# EAGLE design random (EAGLE 7.2.0)
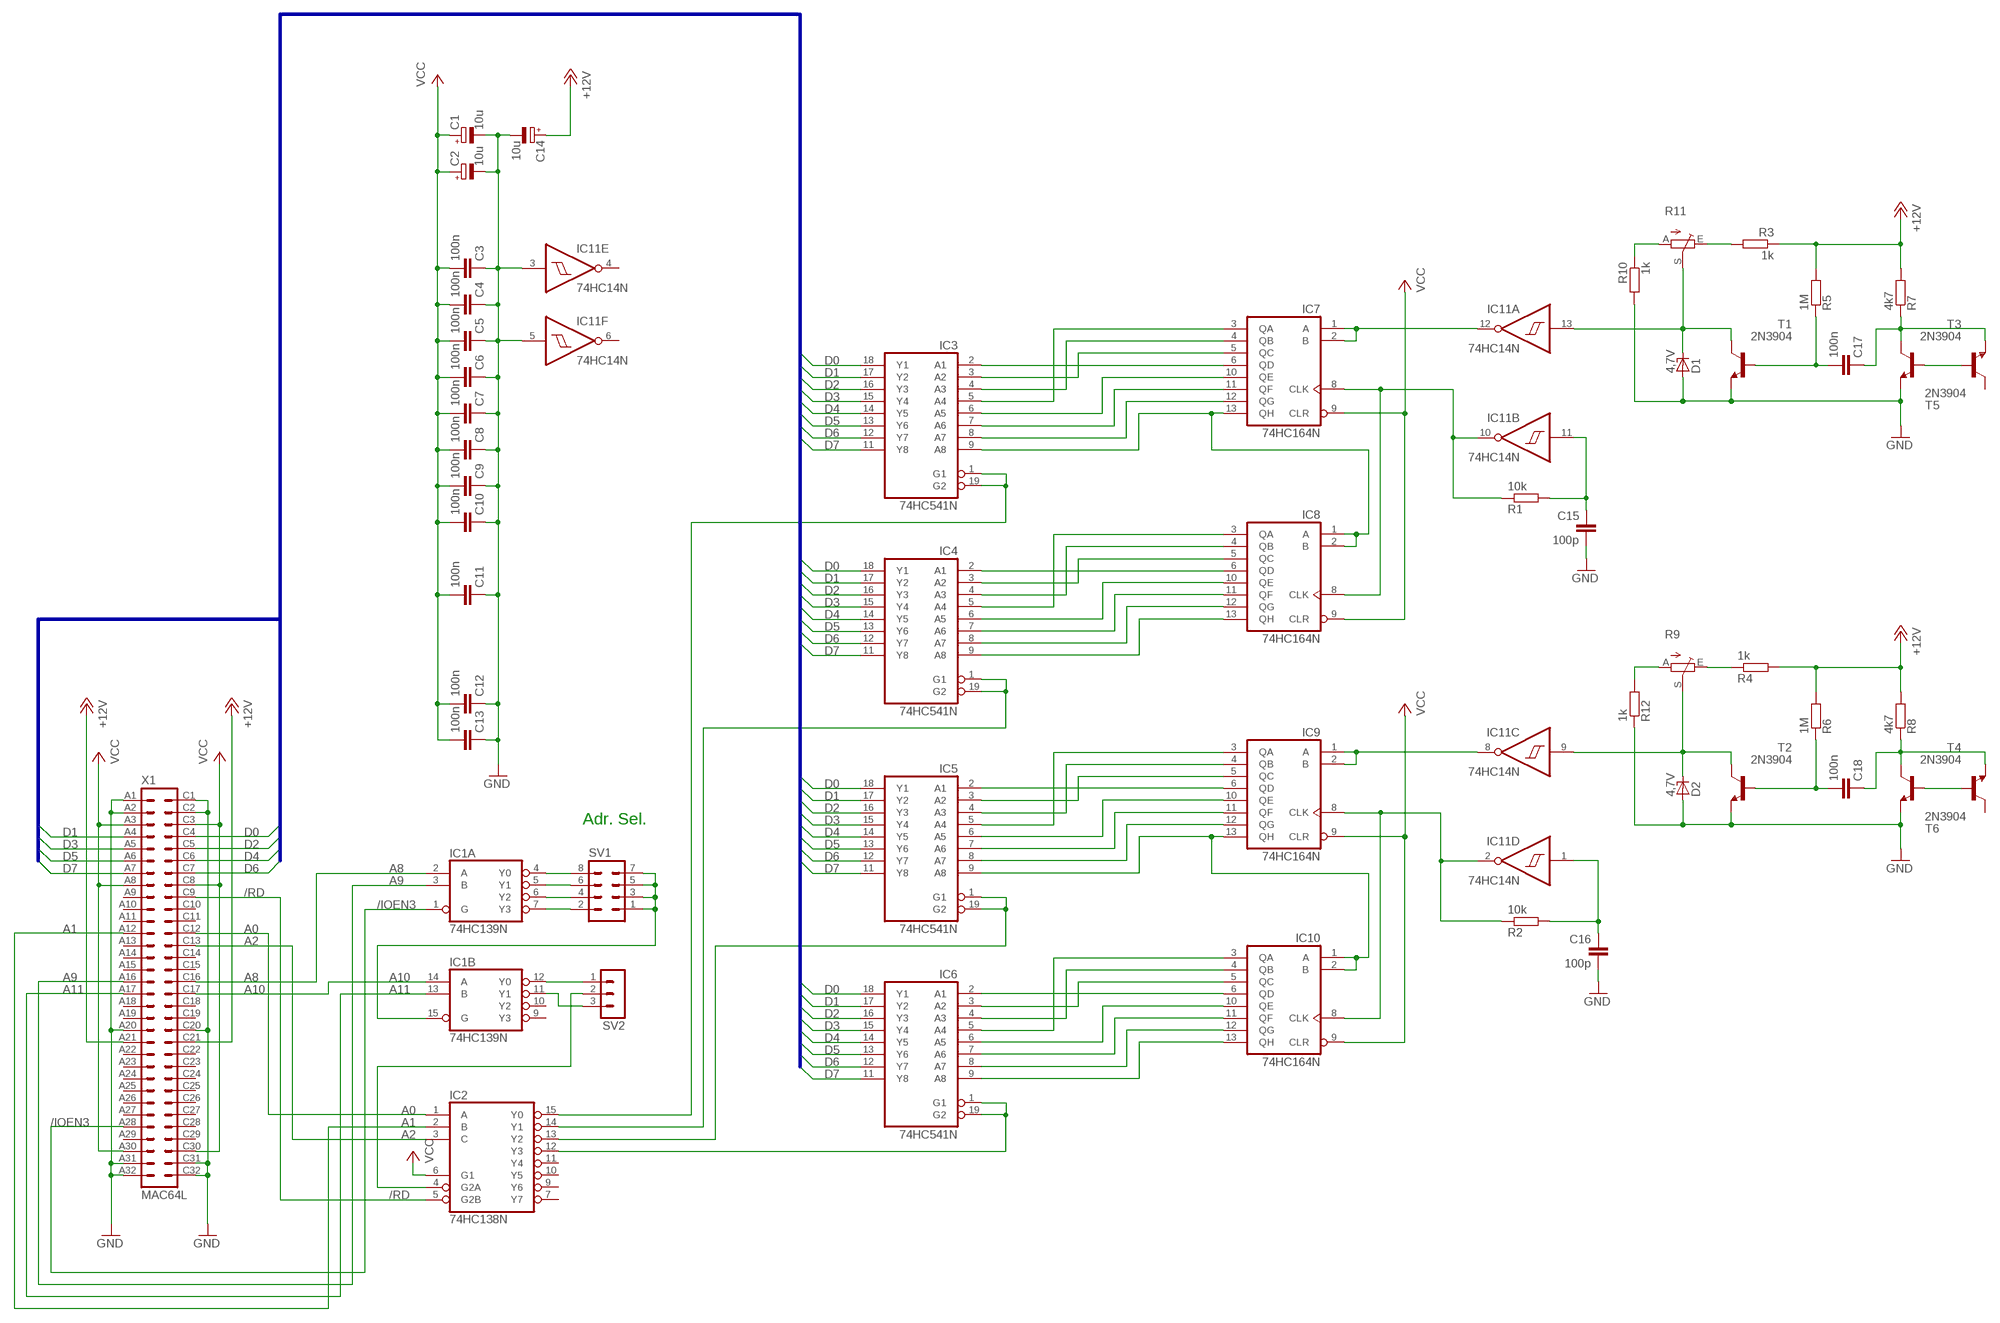
[diagram p0: schematic, sheet 1]

## Parts
C1  10u  CPOL-EUTT2D4  [TT2D4]
C2  10u  CPOL-EUTT2D4  [TT2D4]
C3  100n  C-EU025-024X044  [C025-024X044]
C4  100n  C-EU025-024X044  [C025-024X044]
C5  100n  C-EU025-024X044  [C025-024X044]
C6  100n  C-EU025-024X044  [C025-024X044]
C7  100n  C-EU025-024X044  [C025-024X044]
C8  100n  C-EU025-024X044  [C025-024X044]
C9  100n  C-EU025-024X044  [C025-024X044]
C10  100n  C-EU025-024X044  [C025-024X044]
C11  100n  C-EU025-024X044  [C025-024X044]
C12  100n  C-EU025-024X044  [C025-024X044]
C13  100n  C-EU025-024X044  [C025-024X044]
C14  10u  CPOL-EUTT2D4  [TT2D4]
C15  100p  C-EU025-024X044  [C025-024X044]
C16  100p  C-EU025-024X044  [C025-024X044]
C17  100n  C-EU025-024X044  [C025-024X044]
C18  100n  C-EU025-024X044  [C025-024X044]
D1  4,7V  ZENER-DIODEZD-7.5  [ZDIO-7.5]
D2  4,7V  ZENER-DIODEZD-7.5  [ZDIO-7.5]
IC1  74HC139N  [DIL16]
IC2  74HC138N  [DIL16]
IC3  74HC541N  [DIL20]
IC4  74HC541N  [DIL20]
IC5  74HC541N  [DIL20]
IC6  74HC541N  [DIL20]
IC7  74HC164N  [DIL14]
IC8  74HC164N  [DIL14]
IC9  74HC164N  [DIL14]
IC10  74HC164N  [DIL14]
IC11  74HC14N  [DIL14]
R1  10k  R-EU_0204/7  [0204/7]
R2  10k  R-EU_0204/7  [0204/7]
R3  1k  R-EU_0204/7  [0204/7]
R4  1k  R-EU_0204/7  [0204/7]
R5  1M  R-EU_0204/7  [0204/7]
R6  1M  R-EU_0204/7  [0204/7]
R7  4k7  R-EU_0204/7  [0204/7]
R8  4k7  R-EU_0204/7  [0204/7]
R9  TRIM_EU-S63X  [S63X]
R10  1k  R-EU_0204/7  [0204/7]
R11  TRIM_EU-S63X  [S63X]
R12  1k  R-EU_0204/7  [0204/7]
SV1  MA04-2  [MA04-2]
SV2  MA03-1  [MA03-1]
T1  2N3904  [TO92]
T2  2N3904  [TO92]
T3  2N3904  [TO92]
T4  2N3904  [TO92]
T5  2N3904  [TO92]
T6  2N3904  [TO92]
X1  MAC64L  [MAC64L]

## Nets
+12V: C14.+ R3.1 R4.2 R5.2 R6.2 R7.2 R8.2 X1.A21 X1.C21
/IOEN3: IC1.1(A:G) X1.A28
/RD: IC2.5(G2B) X1.C9
A0: IC2.1(A) X1.C12
A1: IC2.2(B) X1.A12
A2: IC2.3(C) X1.C13
A8: IC1.2(A:A) X1.C16
A9: IC1.3(A:B) X1.A16
A10: IC1.14(B:A) X1.C17
A11: IC1.13(B:B) X1.A17
D0: IC3.18(Y1) IC4.18(Y1) IC5.18(Y1) IC6.18(Y1) X1.C4
D1: IC3.17(Y2) IC4.17(Y2) IC5.17(Y2) IC6.17(Y2) X1.A4
D2: IC3.16(Y3) IC4.16(Y3) IC5.16(Y3) IC6.16(Y3) X1.C5
D3: IC3.15(Y4) IC4.15(Y4) IC5.15(Y4) IC6.15(Y4) X1.A5
D4: IC3.14(Y5) IC4.14(Y5) IC5.14(Y5) IC6.14(Y5) X1.C6
D5: IC3.13(Y6) IC4.13(Y6) IC5.13(Y6) IC6.13(Y6) X1.A6
D6: IC3.12(Y7) IC4.12(Y7) IC5.12(Y7) IC6.12(Y7) X1.C7
D7: IC3.11(Y8) IC4.11(Y8) IC5.11(Y8) IC6.11(Y8) X1.A7
GND: C1.- C2.- C3.1 C4.1 C5.1 C6.1 C7.1 C8.1 C9.1 C10.1 C11.1 C12.1 C13.1 C14.- C15.2 C16.2 D1.A D2.A IC11.3(E:I) IC11.5(F:I) R10.2 R12.1 T1.3(E) T2.3(E) T3.3(E) T4.3(E) X1.A1 X1.A2 X1.A20 X1.A31 X1.A32 X1.C1 X1.C2 X1.C20 X1.C31 X1.C32
N$1: T3.2(B) T5.2(B)
N$2: C17.1 R7.1 T3.1(C) T5.3(E)
N$3: C17.2 R5.1 T1.2(B)
N$4: D1.C IC11.13(A:I) R11.S T1.1(C)
N$5: T4.2(B) T6.2(B)
N$6: C18.1 R8.1 T4.1(C) T6.3(E)
N$7: C18.2 R6.1 T2.2(B)
N$8: D2.C IC11.9(C:I) R9.S T2.1(C)
N$9: C16.1 IC11.1(D:I) R2.2
N$10: IC7.8(CLK) IC8.8(CLK) IC11.10(B:O) R1.1
N$11: C15.1 IC11.11(B:I) R1.2
N$12: IC9.1(A) IC9.2(B) IC11.8(C:O)
N$13: IC5.9(A8) IC9.13(QH) IC10.1(A) IC10.2(B)
N$15: R3.2 R11.E
N$16: R10.1 R11.A
N$17: R4.1 R9.E
N$18: R9.A R12.2
N$20: IC5.2(A1) IC9.6(QD)
N$21: IC5.3(A2) IC9.5(QC)
N$22: IC7.1(A) IC7.2(B) IC11.12(A:O)
N$23: IC3.9(A8) IC7.13(QH) IC8.1(A) IC8.2(B)
N$24: IC5.4(A3) IC9.4(QB)
N$26: IC3.8(A7) IC7.12(QG)
N$27: IC3.7(A6) IC7.11(QF)
N$28: IC3.6(A5) IC7.10(QE)
N$29: IC3.2(A1) IC7.6(QD)
N$30: IC3.3(A2) IC7.5(QC)
N$31: IC3.4(A3) IC7.4(QB)
N$32: IC4.2(A1) IC8.6(QD)
N$33: IC4.3(A2) IC8.5(QC)
N$34: IC4.4(A3) IC8.4(QB)
N$35: IC4.5(A4) IC8.3(QA)
N$36: IC4.6(A5) IC8.10(QE)
N$37: IC4.7(A6) IC8.11(QF)
N$38: IC4.8(A7) IC8.12(QG)
N$39: IC4.9(A8) IC8.13(QH)
N$40: IC5.5(A4) IC9.3(QA)
N$41: IC5.6(A5) IC9.10(QE)
N$42: IC9.8(CLK) IC10.8(CLK) IC11.2(D:O) R2.1
N$44: IC5.7(A6) IC9.11(QF)
N$45: IC5.8(A7) IC9.12(QG)
N$46: IC6.2(A1) IC10.6(QD)
N$47: IC6.3(A2) IC10.5(QC)
N$48: IC6.4(A3) IC10.4(QB)
N$49: IC6.5(A4) IC10.3(QA)
N$50: IC6.6(A5) IC10.10(QE)
N$51: IC6.7(A6) IC10.11(QF)
N$52: IC6.8(A7) IC10.12(QG)
N$53: IC6.9(A8) IC10.13(QH)
N$72: IC1.15(B:G) SV1.1 SV1.3 SV1.5 SV1.7
N$73: IC1.4(A:Y0) SV1.8
N$74: IC1.5(A:Y1) SV1.6
N$75: IC1.6(A:Y2) SV1.4
N$76: IC1.7(A:Y3) SV1.2
N$77: IC1.12(B:Y0) SV2.1
N$78: IC1.11(B:Y1) SV2.3
N$79: IC2.4(G2A) SV2.2
N$80: IC2.15(Y0) IC3.1(G1) IC3.19(G2)
N$81: IC2.14(Y1) IC4.1(G1) IC4.19(G2)
N$82: IC2.13(Y2) IC5.1(G1) IC5.19(G2)
N$83: IC2.12(Y3) IC6.1(G1) IC6.19(G2)
N$86: IC3.5(A4) IC7.3(QA)
VCC: C1.+ C2.+ C3.2 C4.2 C5.2 C6.2 C7.2 C8.2 C9.2 C10.2 C11.2 C12.2 C13.2 IC2.6(G1) IC7.9(CLR) IC8.9(CLR) IC9.9(CLR) IC10.9(CLR) X1.A3 X1.A8 X1.A30 X1.C3 X1.C8 X1.C30
Unconnected: IC1.9(B:Y3) IC1.10(B:Y2) IC2.7(Y7) IC2.9(Y6) IC2.10(Y5) IC2.11(Y4) IC11.4(E:O) IC11.6(F:O) T5.1(C) T6.1(C) X1.A9 X1.A10 X1.A11 X1.A13 X1.A14 X1.A15 X1.A18 X1.A19 X1.A22 X1.A23 X1.A24 X1.A25 X1.A26 X1.A27 X1.A29 X1.C10 X1.C11 X1.C14 X1.C15 X1.C18 X1.C19 X1.C22 X1.C23 X1.C24 X1.C25 X1.C26 X1.C27 X1.C28 X1.C29

## Buses
D[0..7]

## Notes on the sheet
- Adr. Sel.

## Power pins joined to a net without a drawn wire
GND: IC1.8(P:GND) IC2.8(GND) IC3.10(GND) IC4.10(GND) IC5.10(GND) IC6.10(GND) IC7.7(GND) IC8.7(GND) IC9.7(GND) IC10.7(GND) IC11.7(P:GND)
VCC: IC1.16(P:VCC) IC2.16(VCC) IC3.20(VCC) IC4.20(VCC) IC5.20(VCC) IC6.20(VCC) IC7.14(VCC) IC8.14(VCC) IC9.14(VCC) IC10.14(VCC) IC11.14(P:VCC)

## Library data of the parts
C1 C2 C14 = rcl:CPOL-EU: POLARIZED CAPACITOR, European symbol
C3-C13 C15-C18 = rcl:C-EU: CAPACITOR, European symbol
D1 D2 = diode:ZENER-DIODE: Z-Diode
IC1 = 74xx-eu:74*139: Dual 2-line to 4-line DECODER/DEMULTIPLEXER
IC2 = 74xx-eu:74*138: 3-line to 8-line DECODER/DEMULTIPLEXER
IC3-IC6 = 74xx-eu:74*541: Octal BUFFER and LINE DRIVER, 3-state
IC7-IC10 = 74xx-eu:74*164: 8-bit parallel out SHIFT REGISTER
IC11 = 74xx-eu:74*14: Hex schmitt trigger INVERTER
R1-R8 R10 R12 = rcl:R-EU_: RESISTOR, European symbol
R9 R11 = pot:TRIM_EU-: POTENTIOMETER
SV1 = con-lstb:MA04-2: PIN HEADER; OC_FARNELL: unknown; OC_NEWARK: unknown
SV2 = con-lstb:MA03-1: PIN HEADER; OC_FARNELL: unknown; OC_NEWARK: unknown
T1-T6 = transistor-neu-to92:2N3904: NPN TRANSISTOR
X1 = con-vg:MAC64L: CONNECTOR male, 64 pins, block, type C, rows AC, grid 5.08 mm

## Board
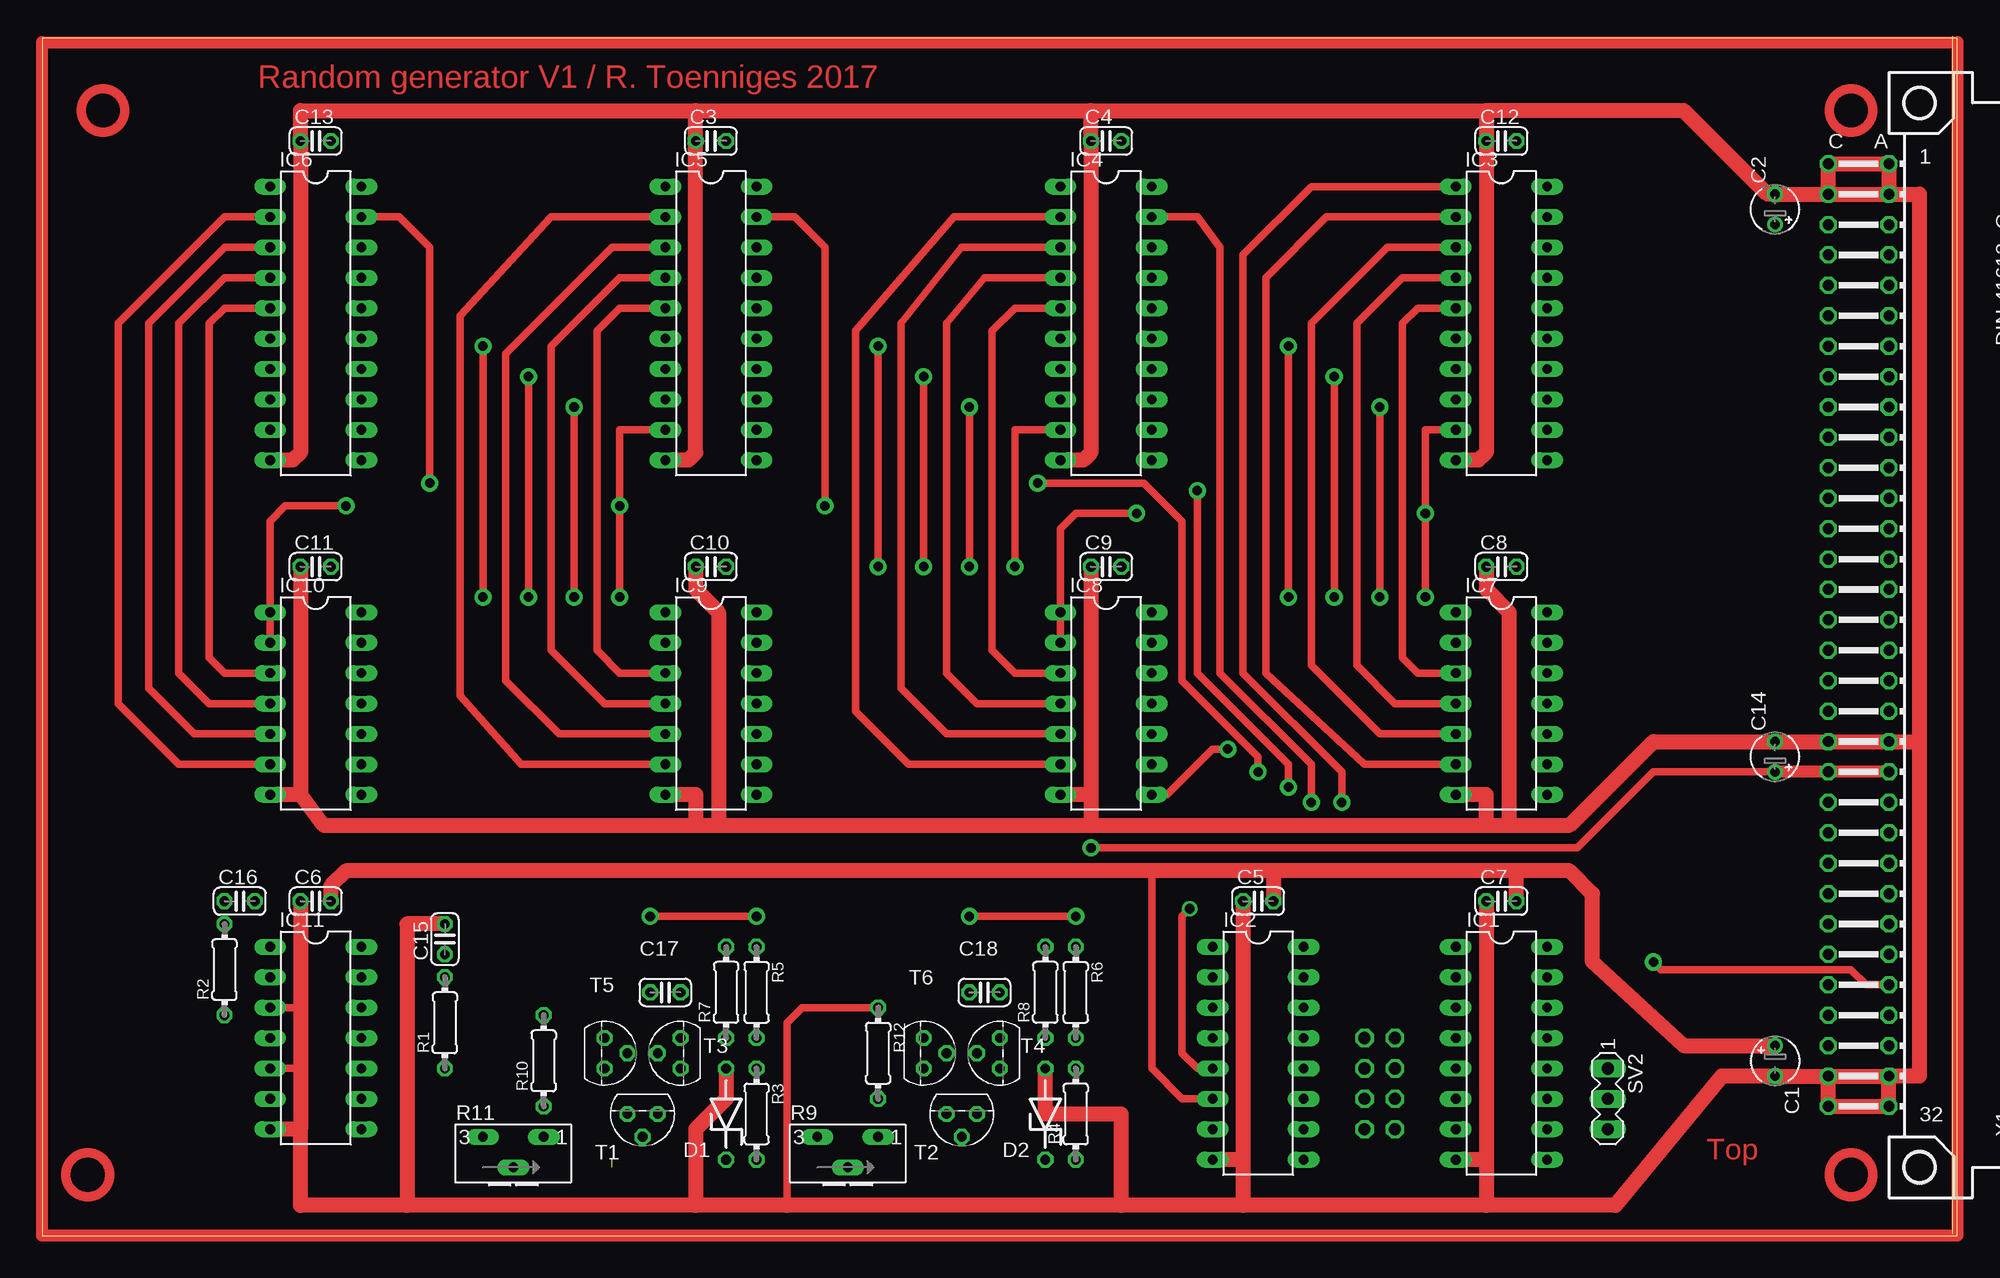
[diagram p1: board, top side]
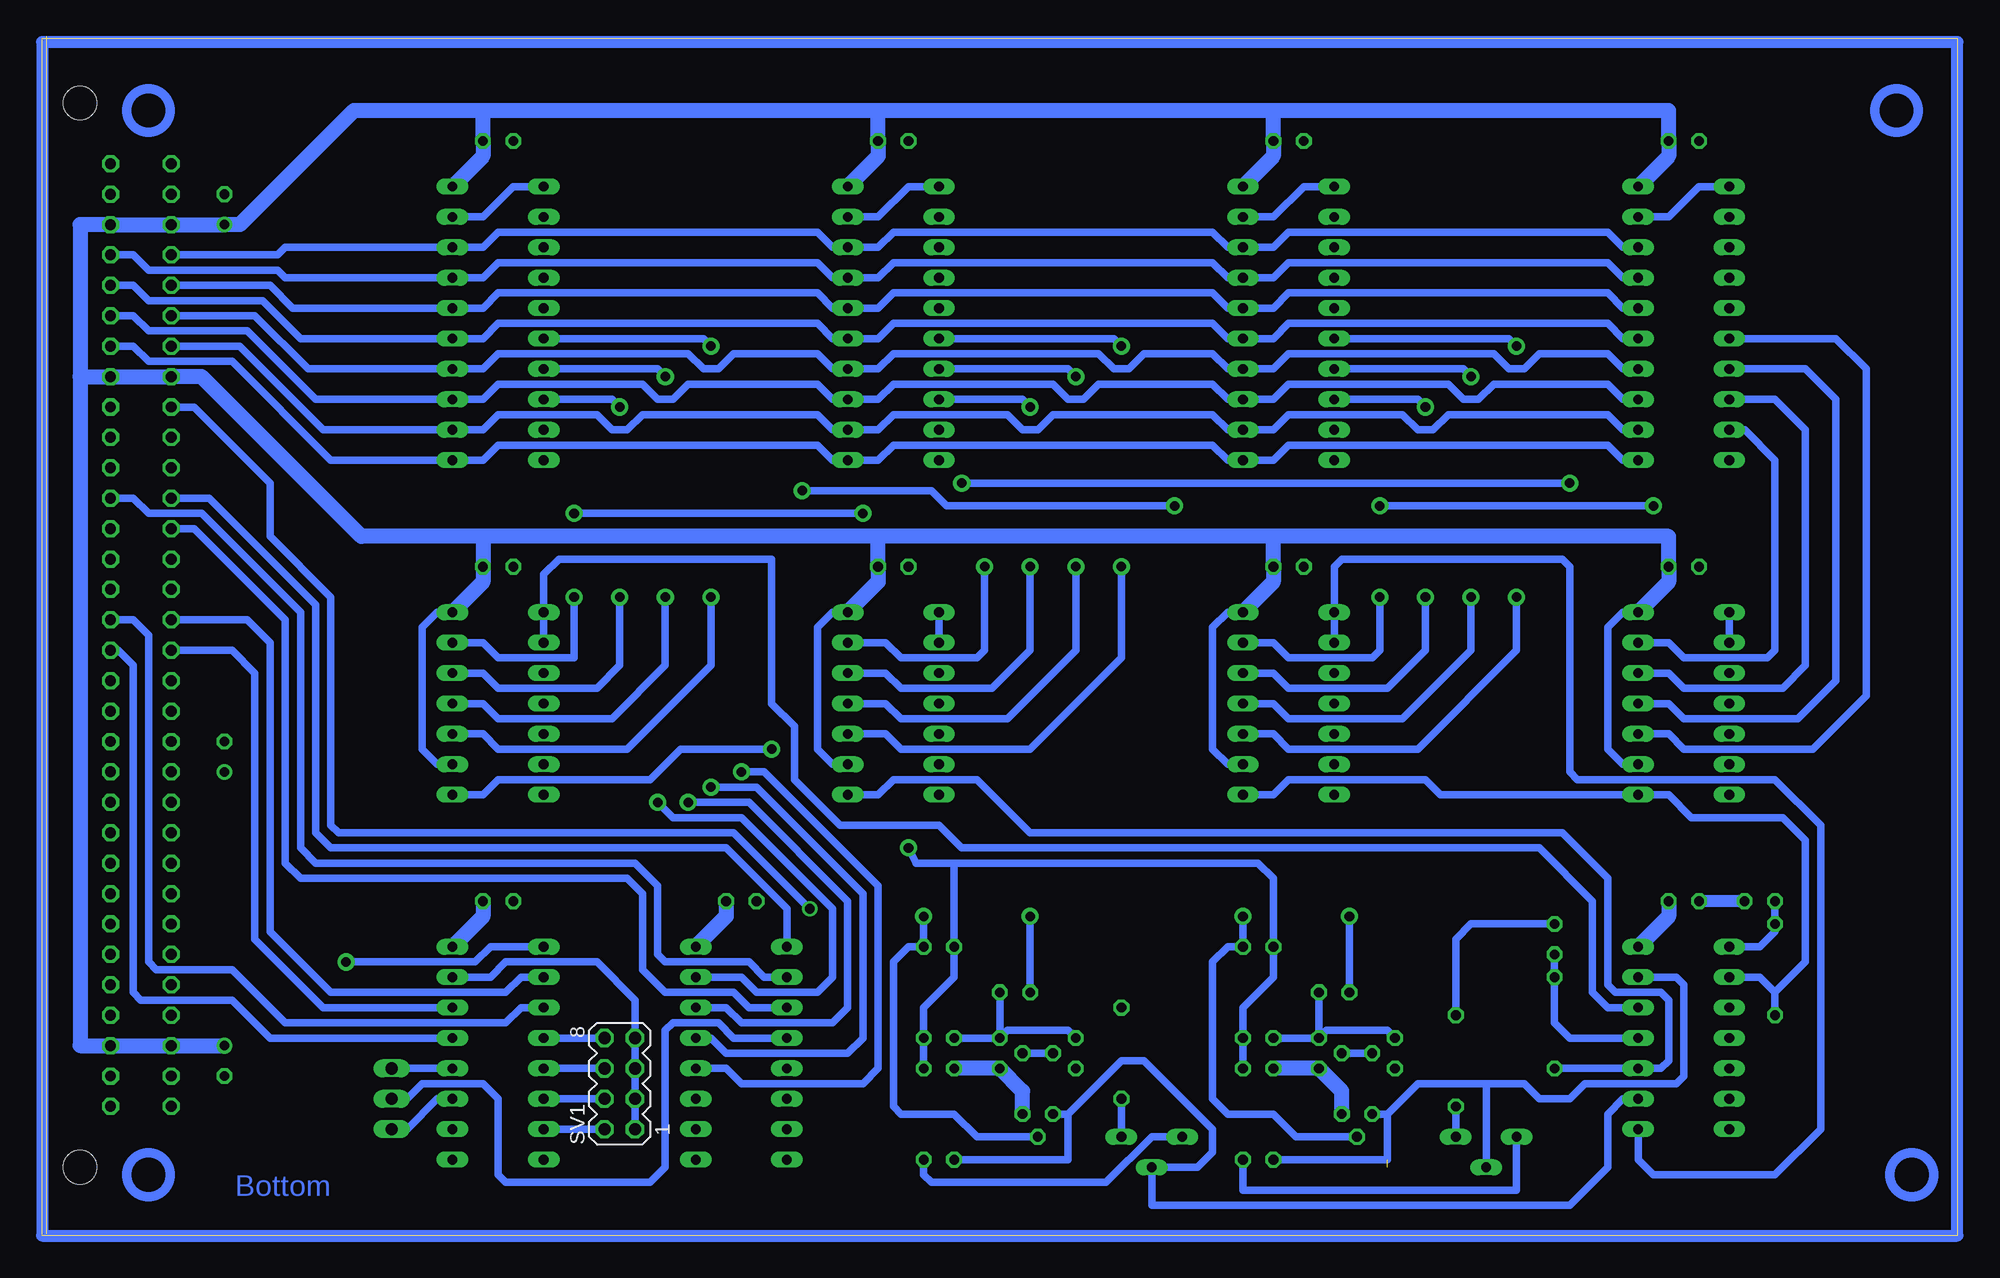
[diagram p2: board, bottom side, seen from below]

Size 160 x 100 mm. Coordinates in mm from the lower left corner, seen from the top.
Outline: 0,0 160,0 160,100 0,100 0,0
Copper layers (1*16): Top 0.035mm / dielectric 1.5mm / Bottom 0.035mm
Design rules "default": minimum track width 10mil, minimum drill 24mil, track to track 8mil, track to pad 8mil, pad to pad 8mil, via to via 8mil, smd to smd 8mil, copper to edge 40mil, drill to drill 8mil, minimum pad ring 10mil, minimum via ring 8mil, stop-mask expansion 4mil, vias tented up to drill 0mil, thermal gap 10mil

### Footprints (pad centres in the part's own frame; a part is rotated, then mirrored left to right if it is on the bottom)
TT2D4 = drill 0.813: + -1.27,0 | drill 0.813 octagon: - 1.27,0
C025-024X044 = drill 0.813 octagon: 1 -1.27,0; 2 1.27,0
ZDIO-7.5 = drill 0.813 octagon: A 3.81,0; C -3.81,0
DIL16 = drill 0.813 long: 1 -8.89,-3.81; 2 -6.35,-3.81; 3 -3.81,-3.81; 4 -1.27,-3.81; 5 1.27,-3.81; 6 3.81,-3.81; 7 6.35,-3.81; 8 8.89,-3.81; 9 8.89,3.81; 10 6.35,3.81; 11 3.81,3.81; 12 1.27,3.81; 13 -1.27,3.81; 14 -3.81,3.81; 15 -6.35,3.81; 16 -8.89,3.81
DIL20 = drill 0.813 long: 1 -11.43,-3.81; 2 -8.89,-3.81; 3 -6.35,-3.81; 4 -3.81,-3.81; 5 -1.27,-3.81; 6 1.27,-3.81; 7 3.81,-3.81; 8 6.35,-3.81; 9 8.89,-3.81; 10 11.43,-3.81; 11 11.43,3.81; 12 8.89,3.81; 13 6.35,3.81; 14 3.81,3.81; 15 1.27,3.81; 16 -1.27,3.81; 17 -3.81,3.81; 18 -6.35,3.81; 19 -8.89,3.81; 20 -11.43,3.81
DIL14 = drill 0.813 long: 1 -7.62,-3.81; 2 -5.08,-3.81; 3 -2.54,-3.81; 4 0,-3.81; 5 2.54,-3.81; 6 5.08,-3.81; 7 7.62,-3.81; 8 7.62,3.81; 9 5.08,3.81; 10 2.54,3.81; 11 0,3.81; 12 -2.54,3.81; 13 -5.08,3.81; 14 -7.62,3.81
0204/7 = drill 0.813 octagon: 1 -3.81,0; 2 3.81,0
S63X = drill 0.813 long: A 2.54,0; E -2.54,0; S 0,-2.54
MA04-2 = drill 1.016 octagon: 1 -3.81,-1.27; 2 -3.81,1.27; 3 -1.27,-1.27; 4 -1.27,1.27; 5 1.27,-1.27; 6 1.27,1.27; 7 3.81,-1.27; 8 3.81,1.27
MA03-1 = drill 1.016 long: 1 -2.54,0; 2 0,0; 3 2.54,0
TO92 = drill 0.813 octagon: 1 1.27,0; 2 0,1.905; 3 -1.27,0
MAC64L = drill 0.914 octagon: A1 -2.54,39.37; A2 -2.54,36.83; A3 -2.54,34.29; A4 -2.54,31.75; A5 -2.54,29.21; A6 -2.54,26.67; A7 -2.54,24.13; A8 -2.54,21.59; A9 -2.54,19.05; A10 -2.54,16.51; A11 -2.54,13.97; A12 -2.54,11.43; A13 -2.54,8.89; A14 -2.54,6.35; A15 -2.54,3.81; A16 -2.54,1.27; A17 -2.54,-1.27; A18 -2.54,-3.81; A19 -2.54,-6.35; A20 -2.54,-8.89; A21 -2.54,-11.43; A22 -2.54,-13.97; A23 -2.54,-16.51; A24 -2.54,-19.05; A25 -2.54,-21.59; A26 -2.54,-24.13; A27 -2.54,-26.67; A28 -2.54,-29.21; A29 -2.54,-31.75; A30 -2.54,-34.29; A31 -2.54,-36.83; A32 -2.54,-39.37; C1 -7.62,39.37; C2 -7.62,36.83; C3 -7.62,34.29; C4 -7.62,31.75; C5 -7.62,29.21; C6 -7.62,26.67; C7 -7.62,24.13; C8 -7.62,21.59; C9 -7.62,19.05; C10 -7.62,16.51; C11 -7.62,13.97; C12 -7.62,11.43; C13 -7.62,8.89; C14 -7.62,6.35; C15 -7.62,3.81; C16 -7.62,1.27; C17 -7.62,-1.27; C18 -7.62,-3.81; C19 -7.62,-6.35; C20 -7.62,-8.89; C21 -7.62,-11.43; C22 -7.62,-13.97; C23 -7.62,-16.51; C24 -7.62,-19.05; C25 -7.62,-21.59; C26 -7.62,-24.13; C27 -7.62,-26.67; C28 -7.62,-29.21; C29 -7.62,-31.75; C30 -7.62,-34.29; C31 -7.62,-36.83; C32 -7.62,-39.37 | hole 2.794: 0,44.45; 0,-44.45

### Placement (x,y rotation side)
C1  144.78,14.61 270 top
C2  144.78,85.72 90 top
C3  55.88,91.44 0 top
C4  88.9,91.44 0 top
C5  101.6,27.94 0 top
C6  22.86,27.94 0 top
C7  121.92,27.94 0 top
C8  121.92,55.88 0 top
C9  88.9,55.88 0 top
C10  55.88,55.88 0 top
C11  22.86,55.88 0 top
C12  121.92,91.44 0 top
C13  22.86,91.44 0 top
C14  144.78,40.01 90 top
C15  33.66,24.77 90 top
C16  16.51,27.94 0 top
C17  52.07,20.32 180 top
C18  78.74,20.32 180 top
D1  57.15,10.16 90 top
D2  83.82,10.16 90 top
IC1  121.92,15.24 270 top
IC2  101.6,15.24 270 top
IC3  121.92,76.2 270 top
IC4  88.9,76.2 270 top
IC5  55.88,76.2 270 top
IC6  22.86,76.2 270 top
IC7  121.92,44.45 270 top
IC8  88.9,44.45 270 top
IC9  55.88,44.45 270 top
IC10  22.86,44.45 270 top
IC11  22.86,16.51 270 top
R1  33.66,17.78 90 top
R2  15.24,22.23 90 top
R3  59.69,10.16 270 top
R4  86.36,10.16 90 top
R5  59.69,20.32 270 top
R6  86.36,20.32 270 top
R7  57.15,20.32 90 top
R8  83.82,20.32 90 top
R9  67.31,8.26 0 top
R10  41.91,14.61 90 top
R11  39.37,8.26 0 top
R12  69.85,15.24 270 top
SV1  111.76,12.7 90 bottom
SV2  130.81,11.43 270 top
T1  50.16,10.16 180 top
T2  76.83,10.16 180 top
T3  53.34,15.24 90 top
T4  80.01,15.24 90 top
T5  46.99,15.24 270 top
T6  73.66,15.24 270 top
X1  156.84,50.16 0 top

### Tracks (layer width: path | path; a pad name or v marks a point on that pad's centre or on a via)
+12V  (via drill 0.8 pad 1.42)
  Top 0.61: C14.+ 134.62,38.73 128.27,32.38 v87.63,32.38
  Top 1.016: X1.A21 X1.C21 C14.+
  Bottom 0.61: R4.2 R6.2 86.36,19.05 83.82,21.59 R8.2 83.82,31.11 | 83.82,31.11 58.42,31.11 57.15,29.84 R7.2 57.15,21.59 59.69,19.05 R5.2 R3.1 | 83.82,31.11 87,31.11 v87.63,32.38
/IOEN3  (via drill 0.8 pad 1.42)
  Top 0.61: v134.62,22.86 135.25,22.23 151.13,22.23 152.4,20.95 X1.A28
  Bottom 0.61: v134.62,22.86 123.83,22.86 122.56,24.13 IC1.1
/RD  (via drill 0.8 pad 1.27)
  Top 0.61: IC2.5 96.52,13.97 95.25,15.24 95.25,26.67 v95.89,27.3
  Bottom 0.61: X1.C9 147.32,69.22 140.97,62.87 140.97,58.42 135.89,53.34 135.89,34.29 135.25,33.66 102.23,33.66 v95.89,27.3
A0
  Bottom 0.61: IC2.1 97.79,27.3 102.87,32.38 135.89,32.38 137.16,33.66 137.16,52.7 146.05,61.59 X1.C12
A1
  Bottom 0.61: IC2.2 99.69,21.59 100.97,22.86 107.95,22.86 108.58,23.5 108.58,29.21 110.49,31.11 137.16,31.11 138.43,32.38 138.43,52.07 146.69,60.33 151.13,60.33 152.4,61.59 X1.A12
A2
  Bottom 0.61: IC2.3 100.97,19.05 102.23,20.32 107.95,20.32 109.86,22.23 109.86,28.57 111.12,29.84 138.43,29.84 139.7,31.11 139.7,51.44 147.32,59.05 X1.C13
A8
  Bottom 0.61: X1.C16 142.88,51.44 140.97,49.53 140.97,25.4 135.89,20.32 121.28,20.32 120.02,21.59 IC1.2
A9
  Bottom 0.61: IC1.3 120.02,19.05 121.28,17.78 139.7,17.78 144.15,22.23 150.5,22.23 151.13,22.86 151.13,50.16 152.4,51.44 X1.A16
A10
  Bottom 0.61: IC1.14 136.53,19.05 142.24,24.77 142.24,46.99 144.15,48.9 X1.C17
A11
  Bottom 0.61: IC1.13 140.97,16.51 144.15,19.68 151.76,19.68 152.4,20.32 152.4,47.62 153.67,48.9 X1.A17
D0
  Bottom 0.61: X1.C4 140.34,81.92 139.7,82.55 IC3.18 123.19,82.55 121.92,83.82 95.25,83.82 93.98,82.55 IC4.18 90.17,82.55 88.9,83.82 62.23,83.82 60.96,82.55 IC5.18 57.15,82.55 55.88,83.82 29.21,83.82 27.94,82.55 IC6.18
D1
  Bottom 0.61: X1.A4 152.4,81.92 151.13,80.64 140.34,80.64 139.7,80.01 IC3.17 123.19,80.01 121.92,81.28 95.25,81.28 93.98,80.01 IC4.17 90.17,80.01 88.9,81.28 62.23,81.28 60.96,80.01 IC5.17 57.15,80.01 55.88,81.28 29.21,81.28 27.94,80.01 IC6.17
D2
  Bottom 0.61: X1.C5 140.97,79.38 139.06,77.47 IC3.16 123.19,77.47 121.92,78.74 95.25,78.74 93.98,77.47 IC4.16 90.17,77.47 88.9,78.74 62.23,78.74 60.96,77.47 IC5.16 57.15,77.47 55.88,78.74 29.21,78.74 27.94,77.47 IC6.16
D3
  Bottom 0.61: X1.A5 152.4,79.38 151.13,78.11 141.6,78.11 138.43,74.93 IC3.15 123.19,74.93 121.92,76.2 95.25,76.2 93.98,74.93 IC4.15 90.17,74.93 88.9,76.2 62.23,76.2 60.96,74.93 IC5.15 57.15,74.93 55.88,76.2 29.21,76.2 27.94,74.93 IC6.15
D4
  Bottom 0.61: X1.C6 142.24,76.83 137.79,72.39 IC3.14 123.19,72.39 122.24,73.34 121.92,73.66 106.05,73.66 104.78,72.39 103.5,72.39 102.23,73.66 95.25,73.66 93.98,72.39 IC4.14 90.17,72.39 88.9,73.66 71.75,73.66 70.48,72.39 69.22,72.39 67.94,73.66 62.23,73.66 60.96,72.39 IC5.14 57.15,72.39 55.88,73.66 38.73,73.66 37.47,72.39 36.2,72.39 34.92,73.66 29.21,73.66 27.94,72.39 IC6.14
D5
  Bottom 0.61: X1.A6 152.4,76.83 151.13,75.56 142.88,75.56 137.16,69.85 IC3.13 123.19,69.85 121.92,71.12 109.86,71.12 108.58,69.85 107.31,69.85 106.05,71.12 95.25,71.12 93.98,69.85 IC4.13 90.17,69.85 88.9,71.12 75.56,71.12 74.3,69.85 73.03,69.85 71.75,71.12 62.23,71.12 60.96,69.85 IC5.13 57.15,69.85 55.88,71.12 42.55,71.12 41.27,69.85 40.01,69.85 38.73,71.12 29.21,71.12 27.94,69.85 IC6.13
D6
  Bottom 0.61: X1.C7 143.51,74.3 136.53,67.31 IC3.12 123.19,67.31 121.92,68.58 113.67,68.58 112.39,67.31 111.12,67.31 109.86,68.58 95.25,68.58 93.98,67.31 IC4.12 90.17,67.31 88.9,68.58 79.38,68.58 78.11,67.31 76.83,67.31 75.56,68.58 62.23,68.58 60.96,67.31 IC5.12 57.15,67.31 55.88,68.58 46.35,68.58 45.09,67.31 43.81,67.31 42.55,68.58 29.21,68.58 27.94,67.31 IC6.12
D7
  Bottom 0.61: X1.A7 152.4,74.3 151.13,73.03 144.15,73.03 135.89,64.77 IC3.11 123.19,64.77 121.92,66.04 95.25,66.04 93.98,64.77 IC4.11 90.17,64.77 88.9,66.04 62.23,66.04 60.96,64.77 IC5.11 57.15,64.77 55.88,66.04 29.21,66.04 27.94,64.77 IC6.11
GND
  Top 0.61: IC11.3 21.59,19.05 | IC11.5 21.59,13.97 | R12.1 63.5,19.05 62.23,17.78 62.23,2.54
  Top 1.27: IC6.10 20.95,64.77 21.59,65.41 C13.1 21.59,93.98 54.61,93.98 | IC5.10 53.98,64.77 54.61,65.41 C3.1 54.61,93.98 | IC4.10 87,64.77 87.63,65.41 C4.1 87.63,93.98 | IC3.10 120.02,64.77 120.65,65.41 C12.1 120.65,93.98 | C7.1 120.65,6.35 | 120.65,6.35 IC1.8 | C5.1 100.33,6.35 | 100.33,6.35 IC2.8 | C6.1 21.59,19.05 21.59,13.97 21.59,8.89 | 21.59,8.89 IC11.7 | C11.1 21.59,36.83 | 21.59,36.83 IC10.7 | IC9.7 54.61,36.83 54.61,34.29 | C9.1 87.63,36.83 | 87.63,36.83 IC8.7 | IC7.7 120.65,36.83 120.65,34.29 | X1.C2 X1.C1 X1.A1 X1.A2 | X1.C2 C2.- 144.15,87 137.16,93.98 120.65,93.98 | X1.C2 X1.A2 | X1.C31 C1.- 140.34,13.34 131.44,2.54 120.65,2.54 | X1.C31 X1.A31 | X1.C31 X1.C32 X1.A32 X1.A31 | 54.61,93.98 87.63,93.98 | 87.63,93.98 120.65,93.98 | X1.A2 156.84,87 156.84,41.27 | 156.84,41.27 156.84,13.34 X1.A31 | 54.61,34.29 23.5,34.29 21.59,36.83 | 54.61,34.29 56.52,34.29 | 56.52,34.29 87.63,34.29 | 87.63,34.29 120.65,34.29 | 87.63,36.83 87.63,34.29 | 120.65,34.29 122.56,34.29 | 122.56,34.29 127.64,34.29 134.62,41.27 C14.- X1.C20 X1.A20 156.84,41.27 | 120.65,2.54 100.33,2.54 | 100.33,2.54 90.17,2.54 | 90.17,2.54 62.23,2.54 54.61,2.54 | 54.61,2.54 30.48,2.54 | 30.48,2.54 21.59,2.54 21.59,8.89 | 100.33,6.35 100.33,2.54 | 120.65,6.35 120.65,2.54 | 90.17,2.54 90.17,10.16 83.82,10.16 D2.A | C8.1 120.65,53.98 122.56,52.07 122.56,34.29 | C10.1 54.61,53.98 56.52,52.07 56.52,34.29 | C15.2 30.48,26.04 30.48,2.54 | D1.A 57.15,11.43 54.61,8.89 54.61,2.54
  Bottom 0.61: C15.2 40.64,26.04 41.91,24.77 R10.2
  Bottom 1.016: C16.2 C6.1
  Bottom 1.27: T1.3 51.44,12.06 T3.3 D1.A | T2.3 78.11,12.06 T4.3 D2.A
N$1
  Bottom 0.61: T5.2 T3.2
N$2
  Bottom 0.61: T3.1 R7.1 | C17.1 T3.1 | T5.3 47.62,17.14 52.7,17.14 T3.1
N$3  (via drill 0.8 pad 1.42)
  Top 0.61: v50.8,26.67 v59.69,26.67
  Bottom 0.61: C17.2 v50.8,26.67 | 59.69,24.77 R5.1 | T1.2 55.24,8.26 57.15,10.16 60.96,10.16 62.23,11.43 62.23,22.86 60.96,24.13 R5.1 | v59.69,26.67 R5.1
N$4  (1 unrouted)
  Bottom 0.61: 47.62,10.16 47.62,6.35 D1.C | IC11.13 23.5,21.59 22.86,20.95 22.86,13.34 23.5,12.7 31.11,12.7 32.38,11.43 34.92,11.43 36.2,12.7 39.37,12.7 | 47.62,10.16 45.09,12.7 39.37,12.7 | 47.62,10.16 T1.1 | R11.S 39.37,12.7
N$5
  Bottom 0.61: T6.2 T4.2
N$6
  Bottom 0.61: T6.3 74.3,17.14 79.38,17.14 T4.1 | T4.1 C18.1 | T4.1 R8.1
N$7  (via drill 0.8 pad 1.42)
  Top 0.61: v77.47,26.67 v86.36,26.67
  Bottom 0.61: C18.2 v77.47,26.67 | T2.2 81.92,8.26 83.82,10.16 88.27,10.16 88.9,10.79 88.9,22.86 87.63,24.13 R6.1 v86.36,26.67
N$8
  Bottom 0.61: D2.C 74.3,6.35 74.3,10.16 | IC11.9 27.94,11.43 29.21,10.16 29.21,5.71 32.38,2.54 67.31,2.54 R9.S 63.5,5.71 62.23,6.99 62.23,8.89 67.94,14.61 69.85,14.61 74.3,10.16 | T2.1 74.3,10.16
N$9
  Bottom 0.61: C16.1 R2.2 15.24,25.4 16.51,24.13 IC11.1
N$10  (via drill 0.8 pad 1.42)
  Top 0.61: v99.06,40.64 97.79,40.64 93.98,36.83 IC8.8
  Bottom 0.61: IC7.8 123.19,36.83 121.92,38.1 109.22,38.1 106.68,40.64 v99.06,40.64 | R1.1 IC11.10 24.77,13.97 24.13,14.61 24.13,19.68 24.77,20.32 28.57,20.32 29.21,20.95 29.21,29.84 33.02,33.66 77.47,33.66 81.92,38.1 88.9,38.1 90.17,36.83 IC8.8
N$11
  Bottom 0.61: IC11.11 32.38,16.51 33.66,17.78 R1.2 C15.1
N$12
  Bottom 0.61: IC9.2 IC9.1 52.07,55.88 51.44,56.52 33.02,56.52 32.38,55.88 32.38,38.73 31.75,38.1 15.24,38.1 11.43,34.29 11.43,8.89 15.24,5.08 25.4,5.08 26.67,6.35 IC11.8
N$13  (via drill 0.8 pad 1.42)
  Top 0.61: IC5.9 48.26,67.31 v48.26,60.96 v48.26,53.34 | IC10.2 19.05,59.69 20.32,60.96 v25.4,60.96
  Bottom 0.61: IC10.2 IC10.1 | IC9.13 57.15,49.53 55.88,48.26 48.9,48.26 48.26,48.9 v48.26,53.34 | v25.4,60.96 v48.26,60.96
N$14
  Bottom 1.016: 0,0 0,99.69 160.02,99.69 160.02,0 0,0
N$15
  Bottom 0.61: R3.2 59.69,3.81 36.83,3.81 R11.E
N$16
  Bottom 0.61: R10.1 R11.A
N$17
  Bottom 0.61: R9.E 67.31,8.26 71.12,4.45 85.72,4.45 86.36,5.08 R4.1
N$18
  Bottom 0.61: R9.A R12.2
N$20
  Top 0.61: IC9.6 40.01,39.37 34.92,45.09 34.92,76.83 42.55,85.09 IC5.2
N$21
  Top 0.61: IC9.5 43.18,41.91 38.73,46.35 38.73,73.66 47.62,82.55 IC5.3
N$22
  Bottom 0.61: IC7.2 IC7.1 118.11,55.24 116.84,56.52 99.06,56.52 99.06,44.45 97.16,42.55 97.16,38.1 93.34,34.29 85.09,34.29 83.19,32.38 34.92,32.38 30.48,27.94 30.48,20.32 29.21,19.05 IC11.12
N$23  (via drill 0.8 pad 1.42)
  Top 0.61: IC3.9 115.57,67.31 v115.57,60.33 v115.57,53.34 | IC8.2 85.09,59.05 86.36,60.33 v91.44,60.33
  Bottom 0.61: IC7.13 123.19,49.53 121.92,48.26 115.57,48.26 v115.57,53.34 | IC8.2 IC8.1 | v91.44,60.33 v115.57,60.33
N$24
  Top 0.61: IC9.4 46.99,44.45 42.55,48.9 42.55,74.3 48.26,80.01 IC5.4
N$26  (via drill 0.8 pad 1.42)
  Top 0.61: v111.76,53.34 v111.76,69.22
  Bottom 0.61: IC7.12 123.19,46.99 121.92,45.72 113.67,45.72 111.76,47.62 v111.76,53.34 | v111.76,69.22 112.39,69.85 IC3.8
N$27  (via drill 0.8 pad 1.42)
  Top 0.61: v107.95,53.34 v107.95,71.75
  Bottom 0.61: IC7.11 123.19,44.45 121.92,43.18 112.39,43.18 107.95,47.62 v107.95,53.34 | v107.95,71.75 108.58,72.39 IC3.7
N$28  (via drill 0.8 pad 1.42)
  Top 0.61: v104.14,53.34 v104.14,74.3
  Bottom 0.61: IC7.10 123.19,41.91 121.92,40.64 111.12,40.64 104.14,47.62 v104.14,53.34 | v104.14,74.3 104.78,74.93 IC3.6
N$29
  Top 0.61: IC7.6 110.49,39.37 102.23,46.99 102.23,80.01 107.31,85.09 IC3.2
N$30
  Top 0.61: IC7.5 111.76,41.91 106.05,47.62 106.05,76.2 112.39,82.55 IC3.3
N$31
  Top 0.61: IC7.4 113.03,44.45 109.86,47.62 109.86,76.2 113.67,80.01 IC3.4
N$32
  Top 0.61: IC8.6 72.39,39.37 67.94,43.81 67.94,75.56 76.2,85.09 IC4.2
N$33
  Top 0.61: IC8.5 75.56,41.91 71.75,45.72 71.75,76.2 76.83,82.55 IC4.3
N$34
  Top 0.61: IC8.4 78.11,44.45 75.56,46.99 75.56,76.2 78.74,80.01 IC4.4
N$35
  Top 0.61: IC8.3 81.28,46.99 79.38,48.9 79.38,75.56 81.28,77.47 IC4.5
N$36  (via drill 0.8 pad 1.42)
  Top 0.61: v69.85,55.88 v69.85,74.3
  Bottom 0.61: IC8.10 89.53,41.91 88.27,40.64 77.47,40.64 69.85,48.26 v69.85,55.88 | v69.85,74.3 70.48,74.93 IC4.6
N$37  (via drill 0.8 pad 1.42)
  Top 0.61: v73.66,55.88 v73.66,71.75
  Bottom 0.61: IC8.11 89.53,44.45 88.27,43.18 79.38,43.18 73.66,48.9 v73.66,55.88 | v73.66,71.75 74.3,72.39 IC4.7
N$38  (via drill 0.8 pad 1.42)
  Top 0.61: v77.47,55.88 v77.47,69.22
  Bottom 0.61: IC8.12 89.53,46.99 88.27,45.72 80.64,45.72 77.47,48.9 v77.47,55.88 | v77.47,69.22 78.11,69.85 IC4.8
N$39  (via drill 0.8 pad 1.42)
  Top 0.61: v81.28,55.88 81.28,67.31 IC4.9
  Bottom 0.61: IC8.13 89.53,49.53 88.27,48.26 81.92,48.26 81.28,48.9 v81.28,55.88
N$40
  Top 0.61: IC9.3 48.26,46.99 46.35,48.9 46.35,75.56 48.26,77.47 IC5.5
N$41  (via drill 0.8 pad 1.42)
  Top 0.61: v36.83,53.34 v36.83,74.3
  Bottom 0.61: IC9.10 57.15,41.91 55.88,40.64 45.09,40.64 36.83,48.9 v36.83,53.34 | v36.83,74.3 37.47,74.93 IC5.6
N$42
  Bottom 0.61: R2.1 15.24,20.32 | 15.24,20.32 16.51,21.59 IC11.2 | IC9.8 57.15,36.83 55.88,38.1 44.45,38.1 43.18,36.83 IC10.8 24.13,36.83 22.23,34.92 14.61,34.92 12.7,33.02 12.7,22.86 15.24,20.32
N$44  (via drill 0.8 pad 1.42)
  Top 0.61: v40.64,53.34 v40.64,71.75
  Bottom 0.61: IC9.11 57.15,44.45 55.88,43.18 46.35,43.18 40.64,48.9 v40.64,53.34 | v40.64,71.75 41.27,72.39 IC5.7
N$45  (via drill 0.8 pad 1.42)
  Top 0.61: v44.45,53.34 v44.45,69.22
  Bottom 0.61: IC9.12 57.15,46.99 55.88,45.72 47.62,45.72 44.45,48.9 v44.45,53.34 | v44.45,69.22 45.09,69.85 IC5.8
N$46
  Top 0.61: IC10.6 11.43,39.37 6.35,44.45 6.35,76.2 15.24,85.09 IC6.2
N$47
  Top 0.61: IC10.5 12.7,41.91 8.89,45.72 8.89,76.2 15.24,82.55 IC6.3 19.68,82.55
N$48
  Top 0.61: IC10.4 13.97,44.45 11.43,46.99 11.43,76.2 15.24,80.01 IC6.4
N$49
  Top 0.61: IC10.3 15.24,46.99 13.97,48.26 13.97,76.2 15.24,77.47 IC6.5
N$50
  Bottom 0.61: IC10.10 24.13,41.91 22.86,40.64 12.06,40.64 7.62,45.09 7.62,72.39 10.16,74.93 IC6.6
N$51
  Bottom 0.61: IC10.11 24.13,44.45 22.86,43.18 13.34,43.18 10.16,46.35 10.16,69.85 12.7,72.39 IC6.7
N$52
  Bottom 0.61: IC10.12 24.13,46.99 22.86,45.72 14.61,45.72 12.7,47.62 12.7,67.31 15.24,69.85 IC6.8
N$53
  Bottom 0.61: IC10.13 24.13,49.53 22.86,48.26 15.88,48.26 15.24,48.9 15.24,64.77 17.78,67.31 IC6.9
N$56
  Top 1.016: 0,0 0,99.69 160.02,99.69 160.02,0 0,0
N$72
  Bottom 0.61: SV1.1 SV1.3 SV1.5 SV1.7 110.49,19.68 113.67,22.86 121.28,22.86 122.56,21.59 IC1.15
N$73
  Bottom 0.61: IC1.4 SV1.8
N$74
  Bottom 0.61: IC1.5 SV1.6
N$75
  Bottom 0.61: IC1.6 SV1.4
N$76
  Bottom 0.61: IC1.7 SV1.2
N$77
  Bottom 0.61: IC1.12 SV2.1
N$78
  Bottom 0.61: SV2.3 129.54,8.89 127,11.43 IC1.11
N$79
  Bottom 0.61: SV2.2 129.54,11.43 128.27,12.7 123.19,12.7 121.92,11.43 121.92,5.08 121.28,4.45 109.22,4.45 107.95,5.71 107.95,17.14 107.31,17.78 103.5,17.78 102.23,16.51 IC2.4
N$80  (via drill 0.8 pad 1.42)
  Top 0.61: IC3.1 106.05,87.63 100.33,81.92 100.33,46.99 108.58,38.73 v108.58,36.2
  Bottom 0.61: IC3.1 120.65,87.63 123.19,85.09 IC3.19 | IC2.15 101.6,21.59 100.33,20.32 95.25,20.32 93.98,21.59 93.98,27.3 101.6,34.92 107.31,34.92 v108.58,36.2
N$81  (via drill 0.8 pad 1.42)
  Top 0.61: IC4.19 96.52,85.09 98.42,82.55 98.42,46.99 106.05,39.37 v106.05,36.2
  Bottom 0.61: IC4.1 87.63,87.63 90.17,85.09 IC4.19 | IC2.14 102.87,19.05 101.6,17.78 93.98,17.78 92.71,19.05 92.71,27.94 100.97,36.2 v106.05,36.2
N$82  (via drill 0.8 pad 1.42)
  Top 0.61: IC5.19 62.87,85.09 65.41,82.55 v65.41,60.96 | v104.14,37.47 104.14,39.37 96.52,46.99 v96.52,62.23
  Bottom 0.61: IC5.1 54.61,87.63 57.15,85.09 IC5.19 | IC2.13 104.14,16.51 102.87,15.24 92.71,15.24 91.44,16.51 91.44,28.57 100.33,37.47 v104.14,37.47 | v96.52,62.23 85.72,62.23 84.45,60.96 v65.41,60.96
N$83  (via drill 0.8 pad 1.42)
  Top 0.61: IC6.19 29.84,85.09 32.38,82.55 v32.38,62.87 | v101.6,38.73 101.6,40.01 95.25,46.35 95.25,59.69 92.08,62.87 v83.19,62.87
  Bottom 0.61: IC6.1 21.59,87.63 24.13,85.09 IC6.19 | v32.38,62.87 v83.19,62.87 | IC2.12 102.87,13.97 101.6,12.7 91.44,12.7 90.17,13.97 90.17,29.21 99.69,38.73 v101.6,38.73
N$86
  Top 0.61: IC7.3 114.94,46.99 113.67,48.26 113.67,76.2 114.94,77.47 IC3.5
VCC
  Top 0.61: IC2.6 95.25,11.43 92.71,13.97 92.71,30.48
  Top 1.27: 123.19,30.48 127.64,30.48 129.54,28.57 129.54,22.86 137.16,15.88 C1.+ | 123.19,30.48 102.87,30.48 | 102.87,30.48 C5.2 | C7.2 123.19,30.48 | 102.87,30.48 92.71,30.48 25.4,30.48 24.13,29.21 C6.2
  Bottom 0.61: IC10.9 27.94,39.37 29.21,40.64 29.21,50.8 27.94,52.07 IC10.14 | IC9.9 60.96,39.37 62.23,40.64 62.23,50.8 60.96,52.07 IC9.14 | IC7.9 127,39.37 128.27,40.64 128.27,50.8 127,52.07 IC7.14 | IC8.9 93.98,39.37 95.25,40.64 95.25,50.8 93.98,52.07 IC8.14
  Bottom 1.27: IC3.20 123.19,90.17 C12.2 123.19,93.98 | IC4.20 90.17,90.17 C4.2 90.17,93.98 | IC5.20 57.15,90.17 C3.2 57.15,93.98 | IC6.20 24.13,90.17 C13.2 24.13,93.98 57.15,93.98 | IC10.14 24.13,54.61 C11.2 24.13,58.42 57.15,58.42 | IC9.14 57.15,54.61 C10.2 57.15,58.42 | IC8.14 90.17,54.61 C9.2 90.17,58.42 | IC7.14 123.19,54.61 C8.2 123.19,58.42 | C6.2 24.13,26.67 IC11.14 | C5.2 102.87,26.67 IC2.16 | C7.2 123.19,26.67 IC1.16 | C1.+ X1.C30 X1.A30 156.84,15.88 156.84,71.75 | 57.15,93.98 90.17,93.98 | 90.17,93.98 123.19,93.98 | 123.19,93.98 133.99,93.98 143.51,84.45 C2.+ X1.C3 X1.A3 156.84,84.45 156.84,71.75 | 156.84,71.75 X1.A8 X1.C8 146.69,71.75 133.35,58.42 123.19,58.42 | 57.15,58.42 90.17,58.42 | 90.17,58.42 123.19,58.42
(copper drawn outside any net)
  shapes: Bottom circle x4, Top circle x4

### Text on the board
Top: Random generator V1 / R. Toenniges 2017 | Top
Bottom: Bottom
tPlace: Remove unused pin from transistors T5 & T6!